# Altium schematic sheet gerilim_okuma.SchDoc
size A4
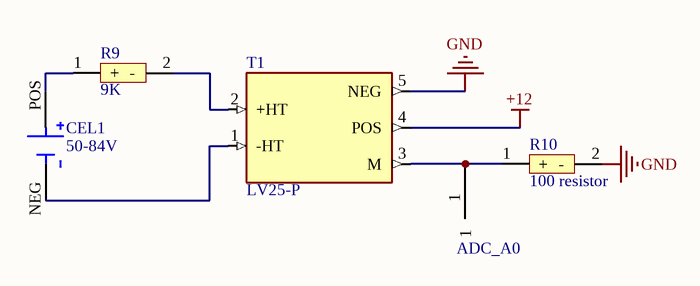
[diagram p0: gerilim_okuma.SchDoc]

## Parts
CEL1  50-84V  [BAT_BA2AAPC-UL94V-0]
P2  ADC_A0  [1pinheader]
R9  9K  [100 resistor]
R10  100 resistor  [100 resistor]
T1  LV25-P  [XDCR_LV25-P]

## Nets
+12: T1.4(POS)
GND: R10.2(-) T1.5(NEG)
NetCEL1_NEG: CEL1.NEG T1.1(-HT)
NetCEL1_POS: CEL1.POS R9.1(+)
NetP2_1: P2.1 R10.1(+) T1.3(M)
NetR9_2: R9.2(-) T1.2(+HT)

## Library data of the parts
CEL1 = CELL: BATTERY HOLDER AA 2 CELL SMD TAB; MF: MPD; MP: BA2AAPC-UL94V-0; Value: *; Price: None; Package: None; Check_prices: https://www.snapeda.com/parts/BA2AAPC-UL94V-0/MPD/view-part/4389111/?ref=eda; Availability: Warning; SnapEDA_Link: https://www.snapeda.com/parts/BA2AAPC-UL94V-0/MPD/view-part/4389111/?ref=snap; Purchase-URL: https://pricing.snapeda.com/search/part/BA2AAPC-UL94V-0/?ref=eda
P2 = 1 pin header
R9 = 100 resistor
T1 = LV25-P: Voltage, Closed Loop Sensor Voltage Output; MF: LEM USA Inc.; SnapEDA_Link: https://www.snapeda.com/parts/LV%2025-P/LEM%20USA%20Inc./view-part/5138977/?ref=snap; Digi-Key_Part_Number: 398-1019-ND; Value: *; Check_prices: https://www.snapeda.com/parts/LV%2025-P/LEM%20USA%20Inc./view-part/5138977/?ref=eda; MP: LV 25-P; Package: None